# EasyEDA Pro project pt4115_led5730.eprj

# Board 202210106
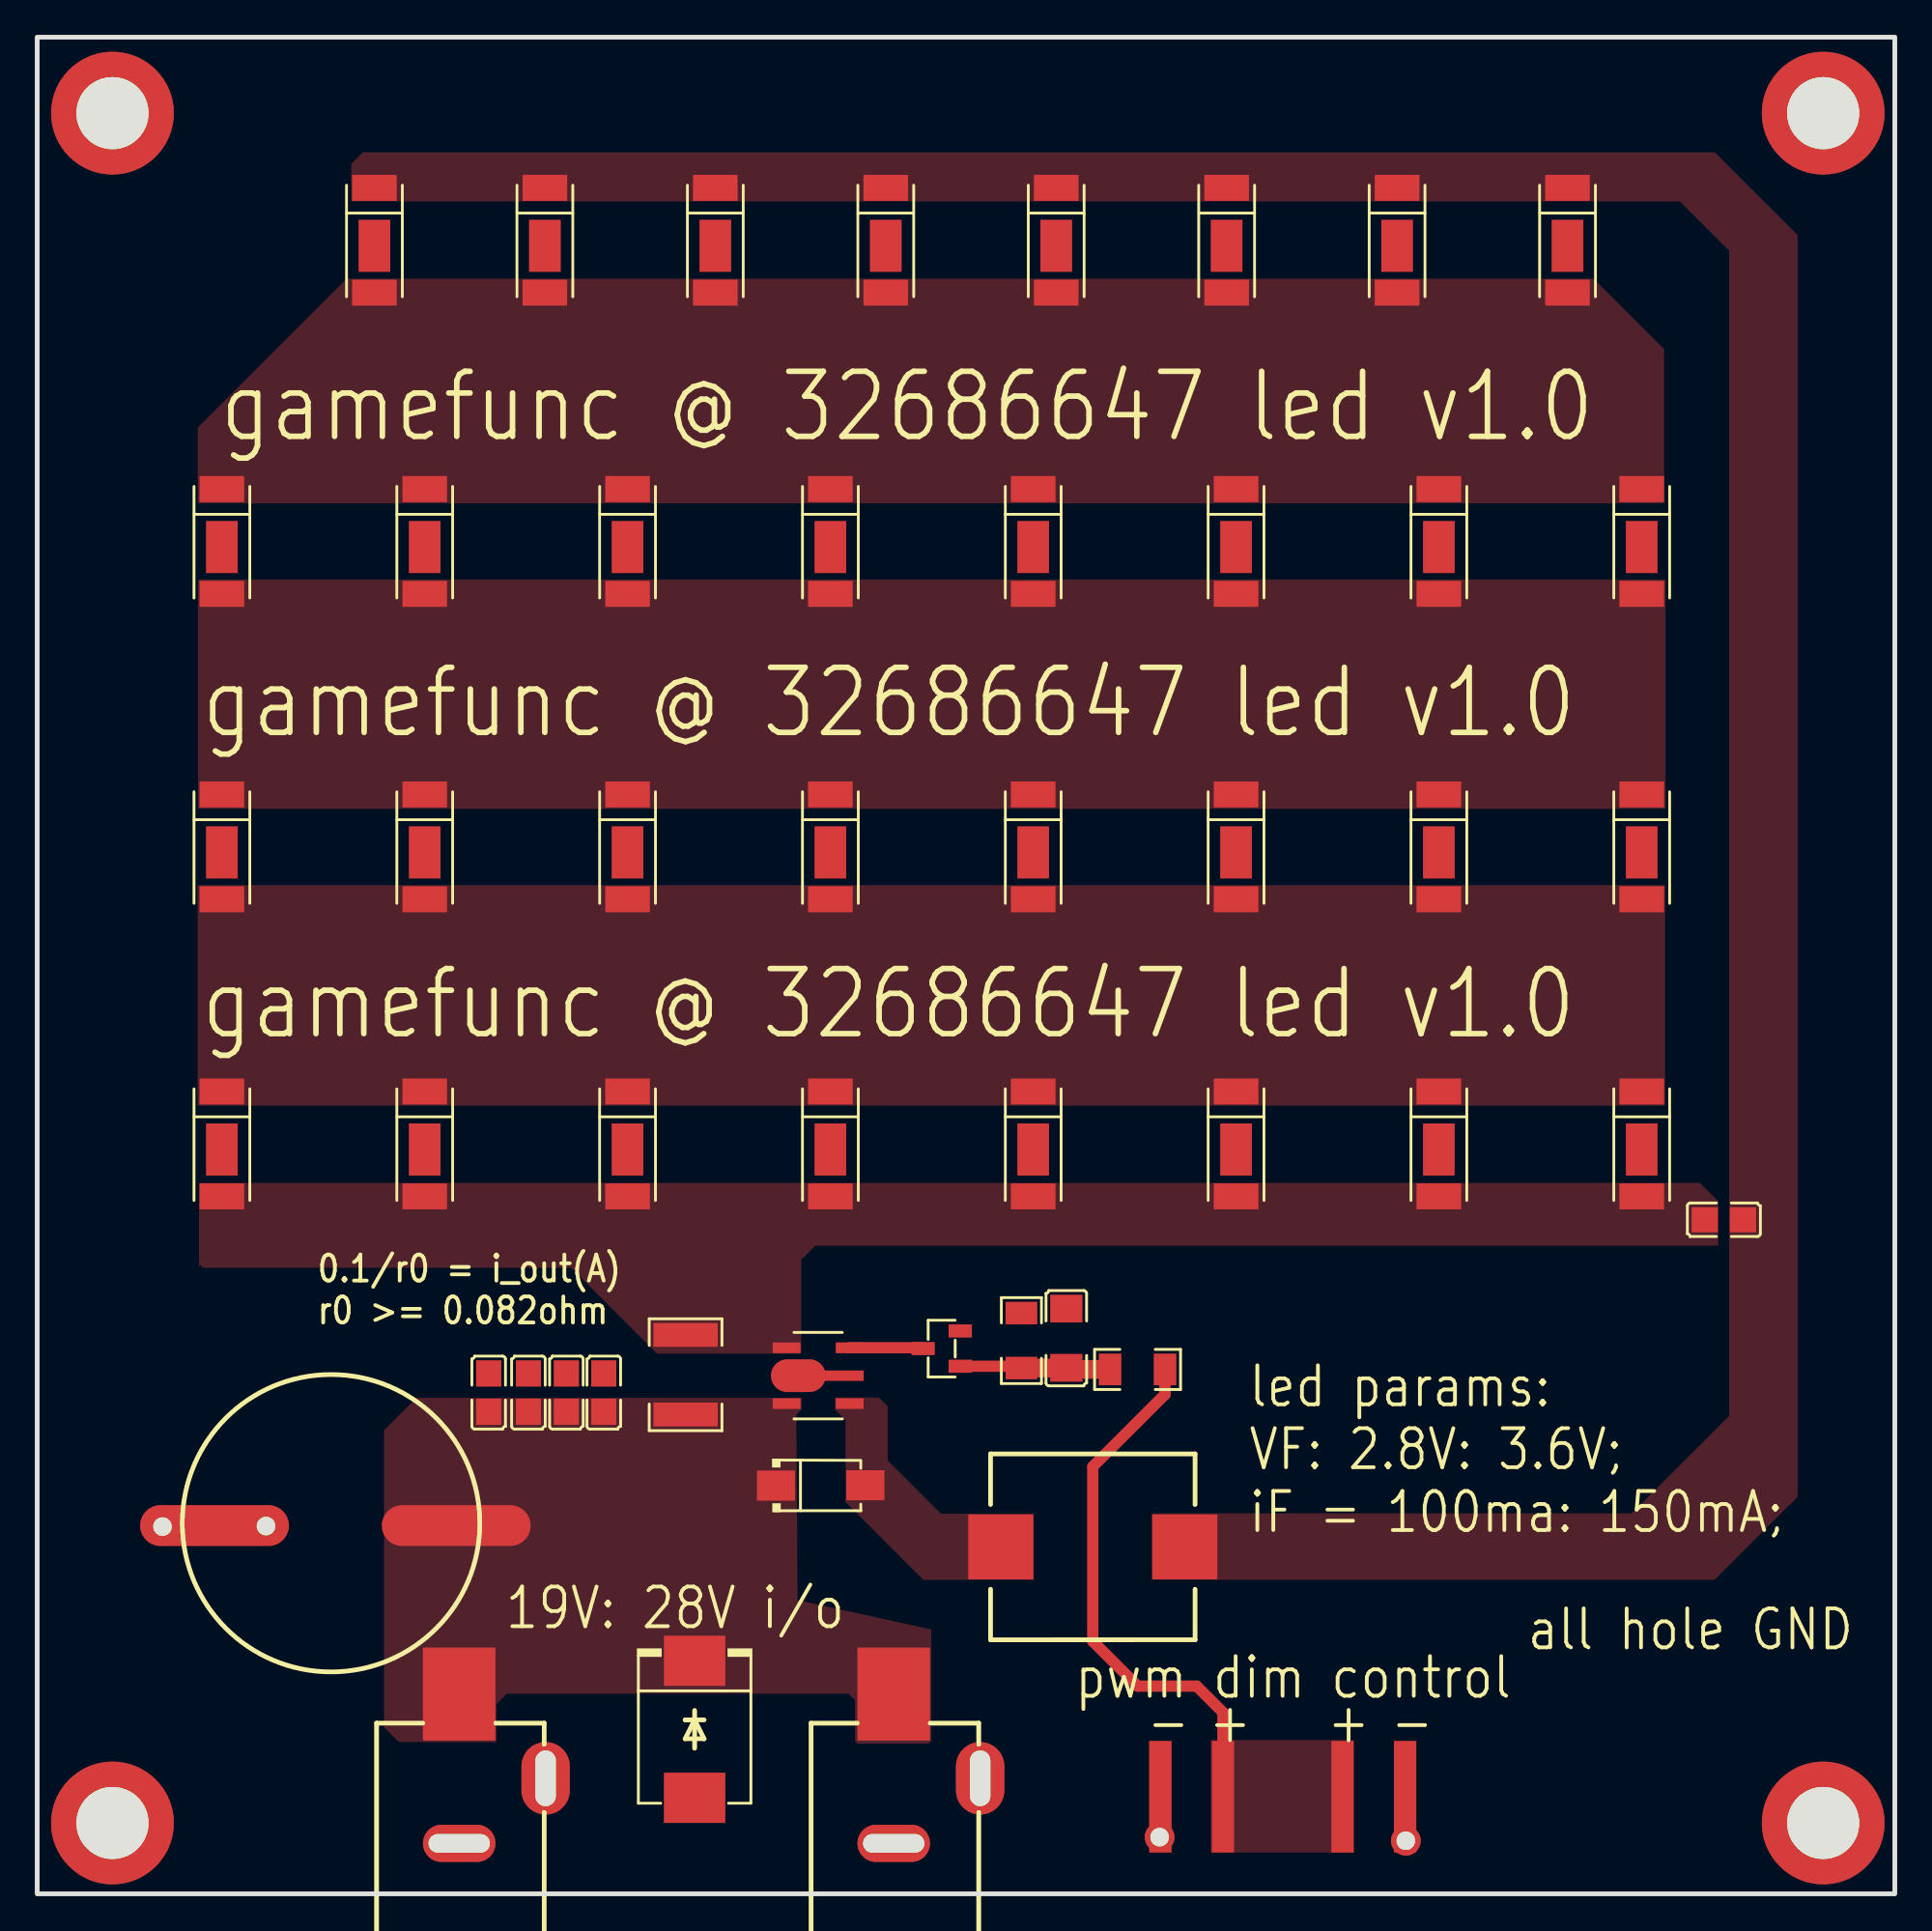
[diagram p0: board, top side]
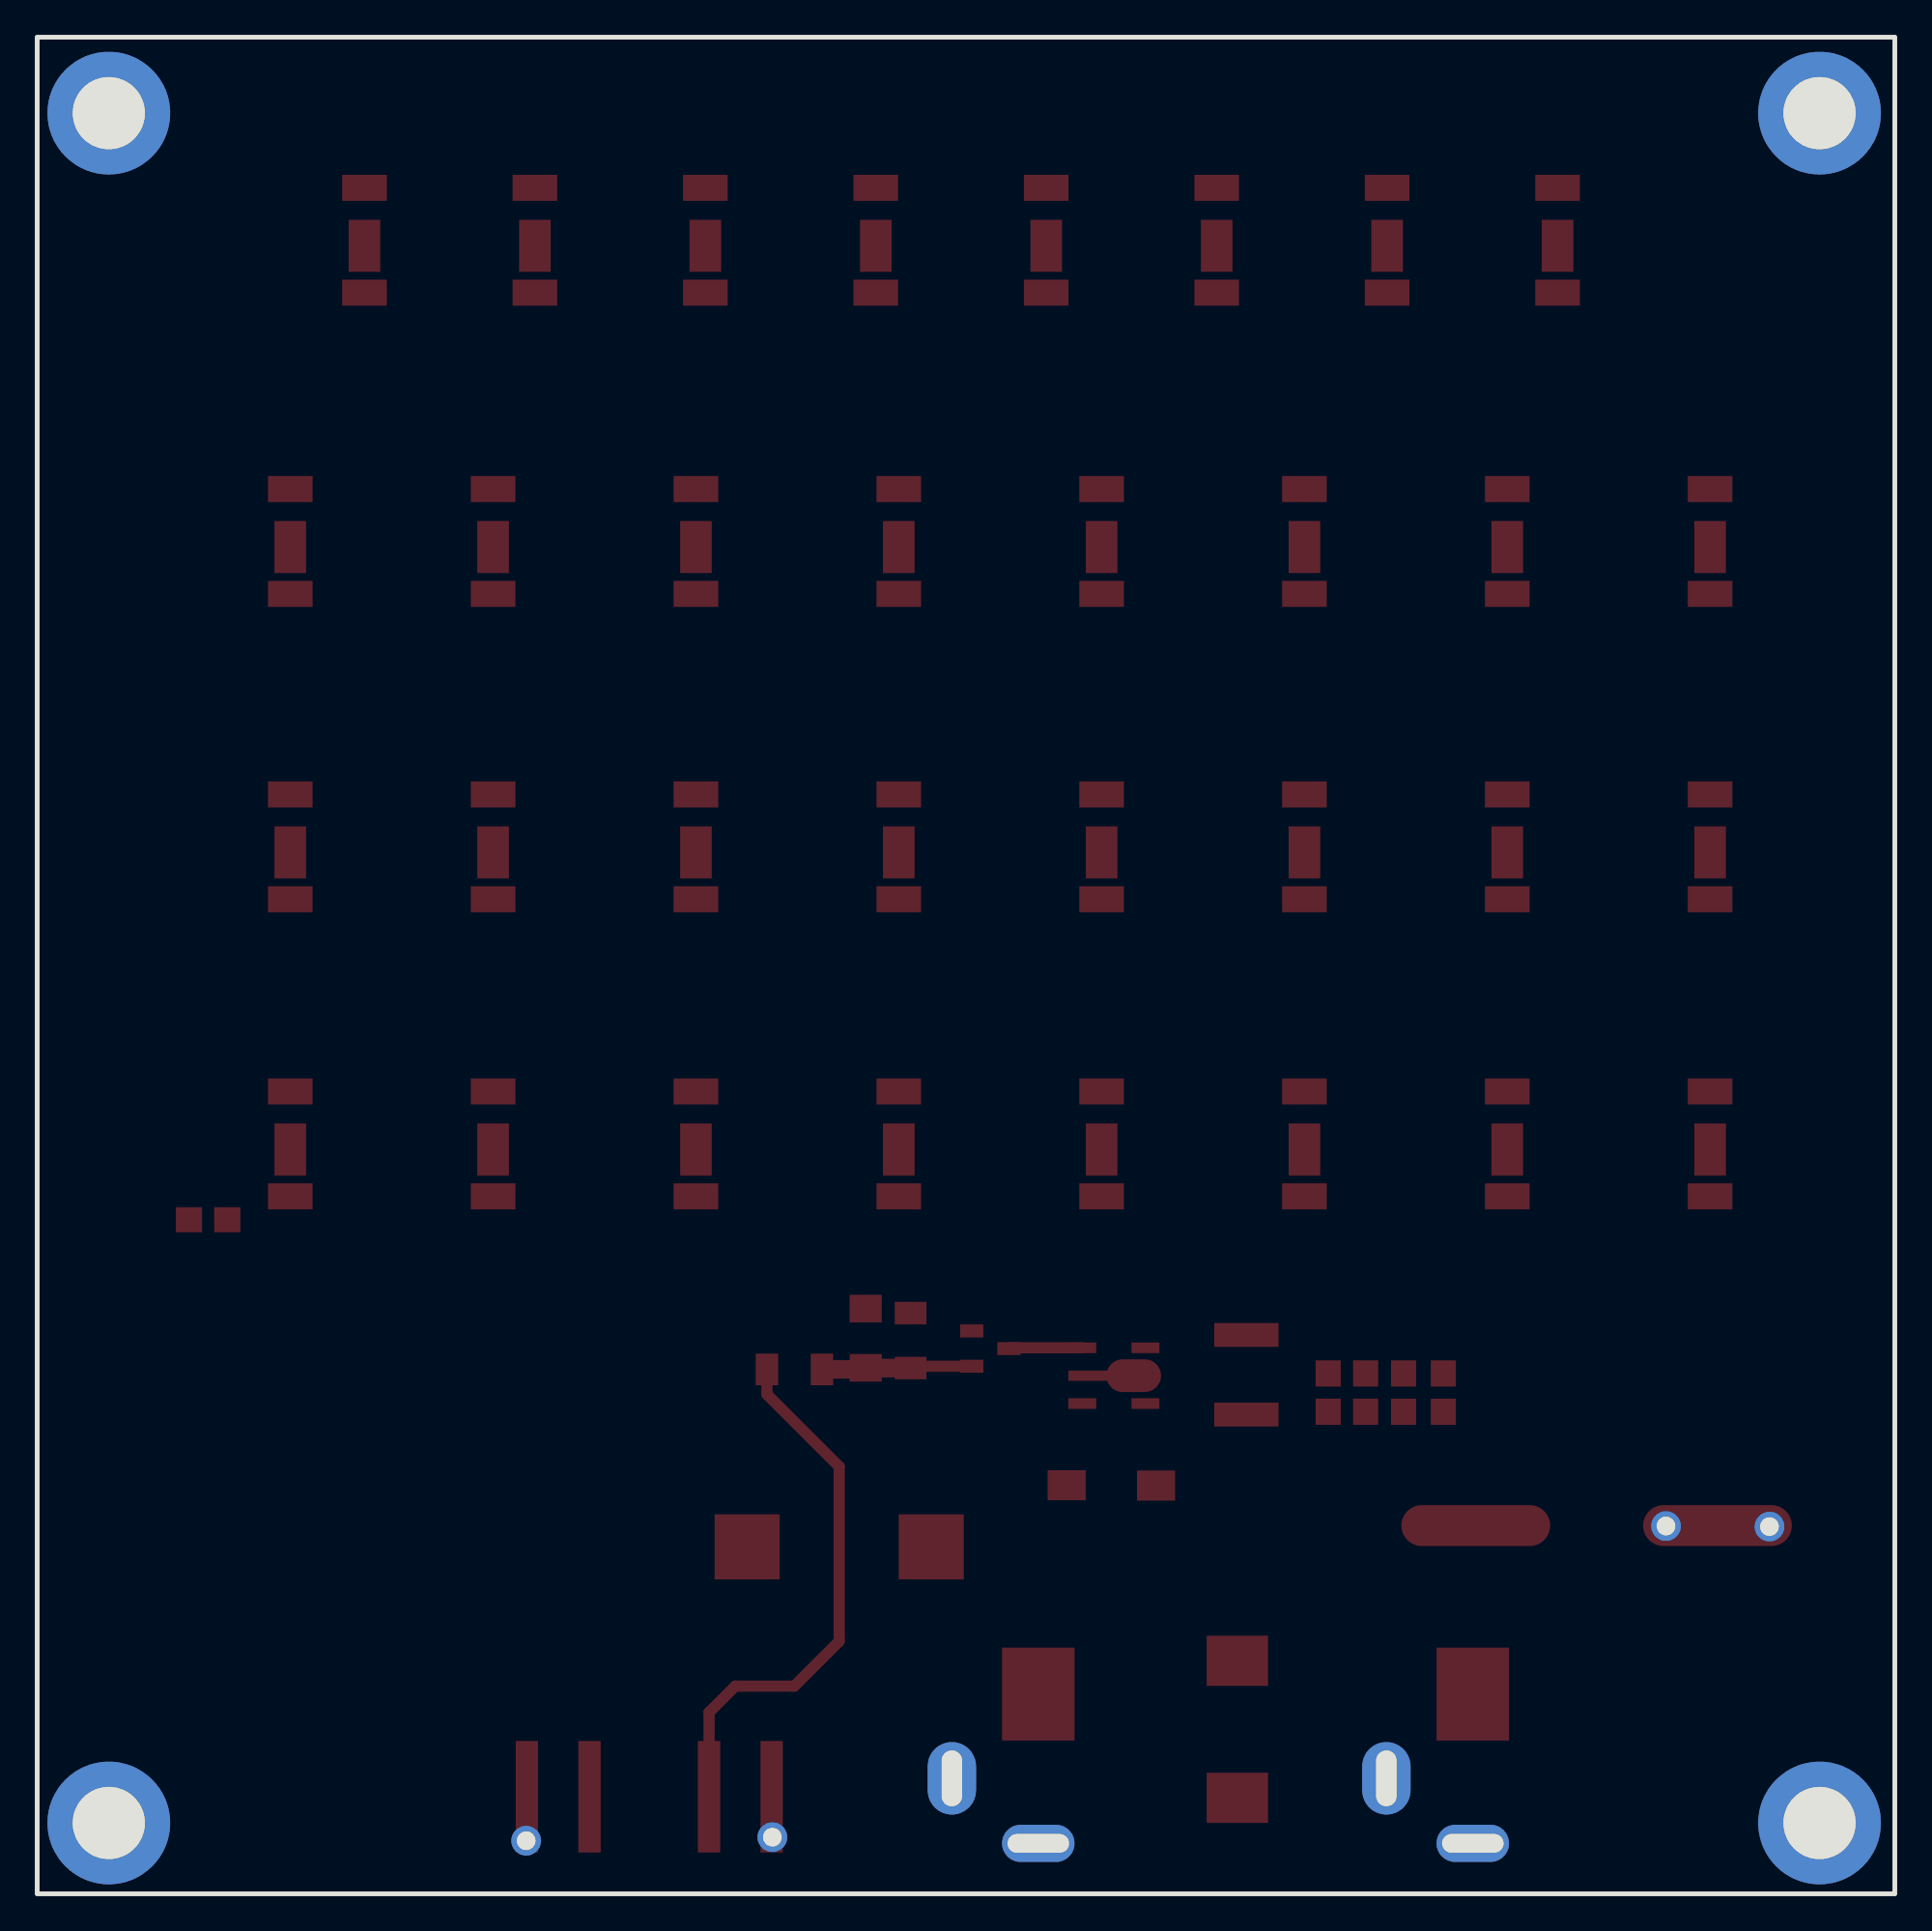
[diagram p1: board, bottom side, seen from below]

Outline 99.9 x 99.9 mm; copper layers: Top Layer, Bottom Layer. Coordinates in mm from the lower left corner of the outline.
Outline path: rectangle 0,99.9 99.9,0
Stack: Top Layer 0.035mm / Dielectric1 1.51mm FR4 er 4.5 / Bottom Layer 0.035mm

## Design rules (mm)
spacing safeClearance (default): track to track 0.152, other pairs 0.152 to 0.3
track width trackWidth (default): min 0.127, default 0.254, max 2.54
differential pair differentialPair (default): width min 0.127, default 0.254, max 2.54; gap min 0.152, default 0.152
via viaSize (default): diameter min 0.5, default 0.61, max 10; hole min 0.3, default 0.305, max 6

## Placement (name value [footprint] x y rotation side)
C1  2mF  [CAP-TH_BD16.0-P7.50-D1.2-FD]  15.8 19.94 180 top
C2  -  [C1206]  55.34 29.9 270 top
C3  -  [C0805]  30.47 26.97 90 top
C4  -  [C0805]  28.46 26.97 90 top
C5  -  [C0805]  26.42 26.97 90 top
C6  -  [C0805]  24.28 26.97 90 top
C7  -  [C0805]  90.71 36.27 180 top
D1  2j  [SMA_L4.3-W2.6-LS5.0-RD]  42.13 21.98 0 top
D2  TVS  [SMC_L6.9-W5.9-LS7.9-RD]  35.36 8.85 270 top
DC1  DC-005QDφ2.0-PU-B  [DC-IN-TH_DC-005-A250]  25.02 5.72 90 top
DC2  DC-005QDφ2.0-PU-B  [DC-IN-TH_DC-005-A250]  48.39 5.72 90 top
L1  -  [IND-SMD_L11.0-W10.0]  56.77 18.67 0 top
LED22  HL-A-5730D1W-S1-08-HR3(LY)(色温2800-3100K)  [LED-SMD_3P-L5.7-W3.0-RD]  27.3 88.97 270 top
LED23  HL-A-5730D1W-S1-08-HR3(LY)(色温2800-3100K)  [LED-SMD_3P-L5.7-W3.0-RD]  36.47 88.97 270 top
LED24  HL-A-5730D1W-S1-08-HR3(LY)(色温2800-3100K)  [LED-SMD_3P-L5.7-W3.0-RD]  45.64 88.97 270 top
LED25  HL-A-5730D1W-S1-08-HR3(LY)(色温2800-3100K)  [LED-SMD_3P-L5.7-W3.0-RD]  54.8 88.97 270 top
LED26  HL-A-5730D1W-S1-08-HR3(LY)(色温2800-3100K)  [LED-SMD_3P-L5.7-W3.0-RD]  63.97 88.97 270 top
LED27  HL-A-5730D1W-S1-08-HR3(LY)(色温2800-3100K)  [LED-SMD_3P-L5.7-W3.0-RD]  73.13 88.97 270 top
LED28  HL-A-5730D1W-S1-08-HR3(LY)(色温2800-3100K)  [LED-SMD_3P-L5.7-W3.0-RD]  18.14 88.97 270 top
LED32  HL-A-5730D1W-S1-08-HR3(LY)(色温2800-3100K)  [LED-SMD_3P-L5.7-W3.0-RD]  82.3 88.97 270 top
LED33  HL-A-5730D1W-S1-08-HR3(LY)(色温2800-3100K)  [LED-SMD_3P-L5.7-W3.0-RD]  20.84 72.77 270 top
LED34  HL-A-5730D1W-S1-08-HR3(LY)(色温2800-3100K)  [LED-SMD_3P-L5.7-W3.0-RD]  31.75 72.77 270 top
LED35  HL-A-5730D1W-S1-08-HR3(LY)(色温2800-3100K)  [LED-SMD_3P-L5.7-W3.0-RD]  64.47 72.77 270 top
LED36  HL-A-5730D1W-S1-08-HR3(LY)(色温2800-3100K)  [LED-SMD_3P-L5.7-W3.0-RD]  75.38 72.77 270 top
LED37  HL-A-5730D1W-S1-08-HR3(LY)(色温2800-3100K)  [LED-SMD_3P-L5.7-W3.0-RD]  42.66 72.77 270 top
LED38  HL-A-5730D1W-S1-08-HR3(LY)(色温2800-3100K)  [LED-SMD_3P-L5.7-W3.0-RD]  53.57 72.77 270 top
LED39  HL-A-5730D1W-S1-08-HR3(LY)(色温2800-3100K)  [LED-SMD_3P-L5.7-W3.0-RD]  86.29 72.77 270 top
LED40  HL-A-5730D1W-S1-08-HR3(LY)(色温2800-3100K)  [LED-SMD_3P-L5.7-W3.0-RD]  9.93 72.77 270 top
LED41  HL-A-5730D1W-S1-08-HR3(LY)(色温2800-3100K)  [LED-SMD_3P-L5.7-W3.0-RD]  20.84 56.34 270 top
LED42  HL-A-5730D1W-S1-08-HR3(LY)(色温2800-3100K)  [LED-SMD_3P-L5.7-W3.0-RD]  31.75 56.34 270 top
LED43  HL-A-5730D1W-S1-08-HR3(LY)(色温2800-3100K)  [LED-SMD_3P-L5.7-W3.0-RD]  64.47 56.34 270 top
LED44  HL-A-5730D1W-S1-08-HR3(LY)(色温2800-3100K)  [LED-SMD_3P-L5.7-W3.0-RD]  75.38 56.34 270 top
LED45  HL-A-5730D1W-S1-08-HR3(LY)(色温2800-3100K)  [LED-SMD_3P-L5.7-W3.0-RD]  42.66 56.34 270 top
LED46  HL-A-5730D1W-S1-08-HR3(LY)(色温2800-3100K)  [LED-SMD_3P-L5.7-W3.0-RD]  53.57 56.34 270 top
LED47  HL-A-5730D1W-S1-08-HR3(LY)(色温2800-3100K)  [LED-SMD_3P-L5.7-W3.0-RD]  86.29 56.34 270 top
LED48  HL-A-5730D1W-S1-08-HR3(LY)(色温2800-3100K)  [LED-SMD_3P-L5.7-W3.0-RD]  9.93 56.34 270 top
LED49  HL-A-5730D1W-S1-08-HR3(LY)(色温2800-3100K)  [LED-SMD_3P-L5.7-W3.0-RD]  20.84 40.35 270 top
LED50  HL-A-5730D1W-S1-08-HR3(LY)(色温2800-3100K)  [LED-SMD_3P-L5.7-W3.0-RD]  31.75 40.35 270 top
LED51  HL-A-5730D1W-S1-08-HR3(LY)(色温2800-3100K)  [LED-SMD_3P-L5.7-W3.0-RD]  64.47 40.35 270 top
LED52  HL-A-5730D1W-S1-08-HR3(LY)(色温2800-3100K)  [LED-SMD_3P-L5.7-W3.0-RD]  75.38 40.35 270 top
LED53  HL-A-5730D1W-S1-08-HR3(LY)(色温2800-3100K)  [LED-SMD_3P-L5.7-W3.0-RD]  42.66 40.35 270 top
LED54  HL-A-5730D1W-S1-08-HR3(LY)(色温2800-3100K)  [LED-SMD_3P-L5.7-W3.0-RD]  53.57 40.35 270 top
LED55  HL-A-5730D1W-S1-08-HR3(LY)(色温2800-3100K)  [LED-SMD_3P-L5.7-W3.0-RD]  86.29 40.35 270 top
LED56  HL-A-5730D1W-S1-08-HR3(LY)(色温2800-3100K)  [LED-SMD_3P-L5.7-W3.0-RD]  9.93 40.35 270 top
NOREF  -  [Pad_e61]  60.4 5.22 180 top
NOREF#2  -  [Pad_e60]  63.77 5.22 180 top
NOREF#3  -  [Pad_e1244]  73.57 5.22 0 top
NOREF#4  -  [Pad_e1678]  73.6 2.86 0 top
NOREF#5  -  [Pad_e1643]  4.05 95.81 0 top
NOREF#6  -  [Pad_e1677]  60.36 3.05 0 top
NOREF#7  -  [Pad_e1646]  4.05 3.81 0 top
NOREF#8  -  [Pad_e1645]  96.05 95.81 0 top
NOREF#9  -  [Pad_e1242]  70.2 5.22 0 top
NOREF#10  -  [Pad_e1647]  96.05 3.81 0 top
Q1  MMBT3904  [SOT-23-3_L2.9-W1.3-P1.90-LS2.4-BR]  48.64 29.34 0 top
R1  -  [R1206]  59.18 28.22 180 top
R2  -  [R1206]  52.93 29.77 270 top
R3  -  [R1812]  34.87 27.93 270 top
U1  PT4115B89E  [SOT-89-5_L4.5-W2.5-P1.50-LS4.5-BR]  42 27.88 0 top

## Footprints (pads in the part's own frame, mm; a bottom-side part is the same pattern mirrored in y, then rotated)
C0805
  rect 1.41x1.35 smd: 1(-1.03,0) 2(1.03,0)
C1206
  rect 1.485x1.728 smd: 1(-1.593,0) 2(1.593,0)
CAP-TH_BD16.0-P7.50-D1.2-FD
  oval 8x2.2 smd: 1(-6.731,0.127) 2(6.269,0.127)
  round 1.6 hole 1: 3(3.498,0.152) 4(9.063,0.182)
DC-IN-TH_DC-005-A250
  rect 5x3.9 smd: 1(5.033,2.325)
  oval 2x3.9 hole 1x3.3: 2(-2.999,2.324)
  oval 3.9x2.6 hole 3x1.1: 3(0.5,-2.324)
IND-SMD_L11.0-W10.0
  rect 3.5x3.5 smd: 1(-4.95,0) 2(4.95,0)
LED-SMD_3P-L5.7-W3.0-RD
  rect 1.4x2.4 smd: 1(-2.82,0) 2(2.82,0)
  rect 2.8x1.7 smd: 3(0.3,0)
Pad_e60
  rect 1.2x6 smd: 1(0,0)
Pad_e61
  rect 1.2x6 smd: 2(0,0)
Pad_e1242
  rect 1.2x6 smd: 30(0,0)
Pad_e1244
  rect 1.2x6 smd: 31(0,0)
Pad_e1643
  round 6.6 hole 3.88: 1(0,0)
Pad_e1645
  round 6.6 hole 3.88: 49(0,0)
Pad_e1646
  round 6.6 hole 3.88: 50(0,0)
Pad_e1647
  round 6.6 hole 3.88: 51(0,0)
Pad_e1677
  round 1.6 hole 1: 154(0,0)
Pad_e1678
  round 1.6 hole 1: 155(0,0)
R1206
  rect 1.208x1.701 smd: 1(-1.479,0) 2(1.479,0)
R1812
  rect 1.282x3.457 smd: 1(-2.141,0) 2(2.141,0)
SMA_L4.3-W2.6-LS5.0-RD
  rect 2.047x1.621 smd: 1(-2.403,-0.01) 2(2.403,0.01)
SMC_L6.9-W5.9-LS7.9-RD
  rect 2.7x3.3 smd: 1(-3.687,0) 2(3.687,0)
SOT-23-3_L2.9-W1.3-P1.90-LS2.4-BR
  rect 1.25x0.7 smd: 1(1,-0.95) 2(1,0.95) 3(-1,0)
SOT-89-5_L4.5-W2.5-P1.50-LS4.5-BR
  rect 1.5x0.574 smd: 1(1.698,-1.5) 3(1.698,1.5) 4(-1.698,1.5) 5(-1.698,-1.5)
  rect 2.209x0.552 smd: 2(1.343,0)
  oval 2.94x1.76 smd: 6(-1.067,0)

## Nets
DGND: C1.2 C1.3 C1.4 C2.1 C3.2 C4.2 C5.2 C6.2 D2.2 DC1.2 DC1.3 DC2.2 DC2.3 NOREF.2 NOREF#3.31 NOREF#4.155 NOREF#5.1 NOREF#6.154 NOREF#7.50 NOREF#8.49 NOREF#10.51 Q1.2 R2.1 U1.2 U1.6
VIN: C1.1 C3.1 C4.1 C5.1 C6.1 D1.1 D2.1 DC1.1 DC2.1 R3.2 U1.5
B: C2.2 Q1.1 R1.2 R2.2
CSN00: C7.2 LED49.2 LED50.2 LED51.2 LED52.2 LED53.2 LED54.2 LED55.2 LED56.2 R3.1 U1.4
CSN01: LED41.2 LED42.2 LED43.2 LED44.2 LED45.2 LED46.2 LED47.2 LED48.2 LED49.1 LED50.1 LED51.1 LED52.1 LED53.1 LED54.1 LED55.1 LED56.1
CSN02: LED33.2 LED34.2 LED35.2 LED36.2 LED37.2 LED38.2 LED39.2 LED40.2 LED41.1 LED42.1 LED43.1 LED44.1 LED45.1 LED46.1 LED47.1 LED48.1
CSN03: LED22.2 LED23.2 LED24.2 LED25.2 LED26.2 LED27.2 LED28.2 LED32.2 LED33.1 LED34.1 LED35.1 LED36.1 LED37.1 LED38.1 LED39.1 LED40.1
CSN04: C7.1 L1.2 LED22.1 LED23.1 LED24.1 LED25.1 LED26.1 LED27.1 LED28.1 LED32.1
DIM_0: Q1.3 U1.3
GPIO_IN: NOREF#2.1 NOREF#9.30 R1.1
SW_0: D1.2 L1.1 U1.1

Pads without a net: LED22 3; LED23 3; LED24 3; LED25 3; LED26 3; LED27 3; LED28 3; LED32 3; LED33 3; LED34 3; LED35 3; LED36 3; LED37 3; LED38 3; LED39 3; LED40 3; LED41 3; LED42 3; LED43 3; LED44 3; LED45 3; LED46 3; LED47 3; LED48 3; LED49 3; LED50 3; LED51 3; LED52 3; LED53 3; LED54 3; LED55 3; LED56 3

## Routing (per net, layer and track width the routed paths; a pad name or vN(x,y) marks a point on that pad's centre or on a via; arc(x,y) is an arc through that point)
B: length 8.1
  Top Layer w0.6: Q1.1 52.83,28.39 R2.2
  Top Layer w1: R1.2 55.43,28.22 C2.2 55.33,28.29 R2.2
DIM_0: length 4
  Top Layer w0.6: U1.3 47.6,29.38 Q1.3
GPIO_IN: length 29.4
  Top Layer w0.6: R1.1 60.66,26.87 56.77,22.99 56.77,13.59 59.18,11.18 62.36,11.18 63.77,9.77 NOREF#2.1

## Copper pours and planes (outline as drawn; the poured copper is in the pictures)
DGND on Top Layer: -21.08,113.28 157.23,113.28 137.41,93.47 137.41,-44.7 -51.82,-44.7 -66.04,-30.48 -21.08,14.48
VIN on Top Layer: 18.65,26.69 48.09,26.69 48.09,8.08 18.65,8.08
CSN00 on Top Layer: 8.7,38.25 90.41,38.25 90.41,29.06 8.7,29.06
CSN01 on Top Layer: 8.63,54.27 87.55,54.27 87.55,42.41 8.63,42.41
CSN02 on Top Layer: 8.65,70.72 87.57,70.72 87.57,58.38 8.65,58.38
CSN03 on Top Layer: 8.64,86.91 87.5,86.91 87.5,74.82 8.64,74.82
CSN04 on Top Layer: 16.89,93.7 94.68,93.7 94.68,16.89 16.89,16.89
GPIO_IN on Top Layer: 63.12,8.28 70.81,8.28 70.81,2.22 63.12,2.22
SW_0 on Top Layer: 42.9,26.7 53.6,26.7 53.6,16.89 42.9,16.89

## Text on the board
Top Silkscreen Layer: 0.1/r0 = i_out(A) / r0 >= 0.082ohm | led params: / VF: 2.8V: 3.6V; / iF = 100ma: 150mA; | all hole GND | 19V: 28V i/o | pwm dim control | - | + | gamefunc @ 32686647 led v1.0
